# Altium schematic sheet 08_LMS7002M_2_Power.SchDoc: LMS7002M #2 power supply
size A3 portrait; Organization: Lime Microsystems; Address1: Surrey Tech Centre; Address2: Guildford GU2 7YG; Address3: Surrey; Address4: United Kingdom; Revision: v1.2; SheetNumber: 8; SheetTotal: 27; PageSetup: Record=PageOptions|CenterHorizontal=True|CenterVertical=True|PrintScale=0.70|XCorrection=1.00|YCorrection=1.00|PrintKind=1|BorderSize=5000000|LeftOffset=0|BottomOffset=0|Orientation=1|PaperLength=2970|PaperWidth=2100|Scale=100|PaperSource=7|PrintQuality=600|MediaType=1|DitherType=10|PrintScaleMode=1|PaperKind=A4|PaperIndex=9
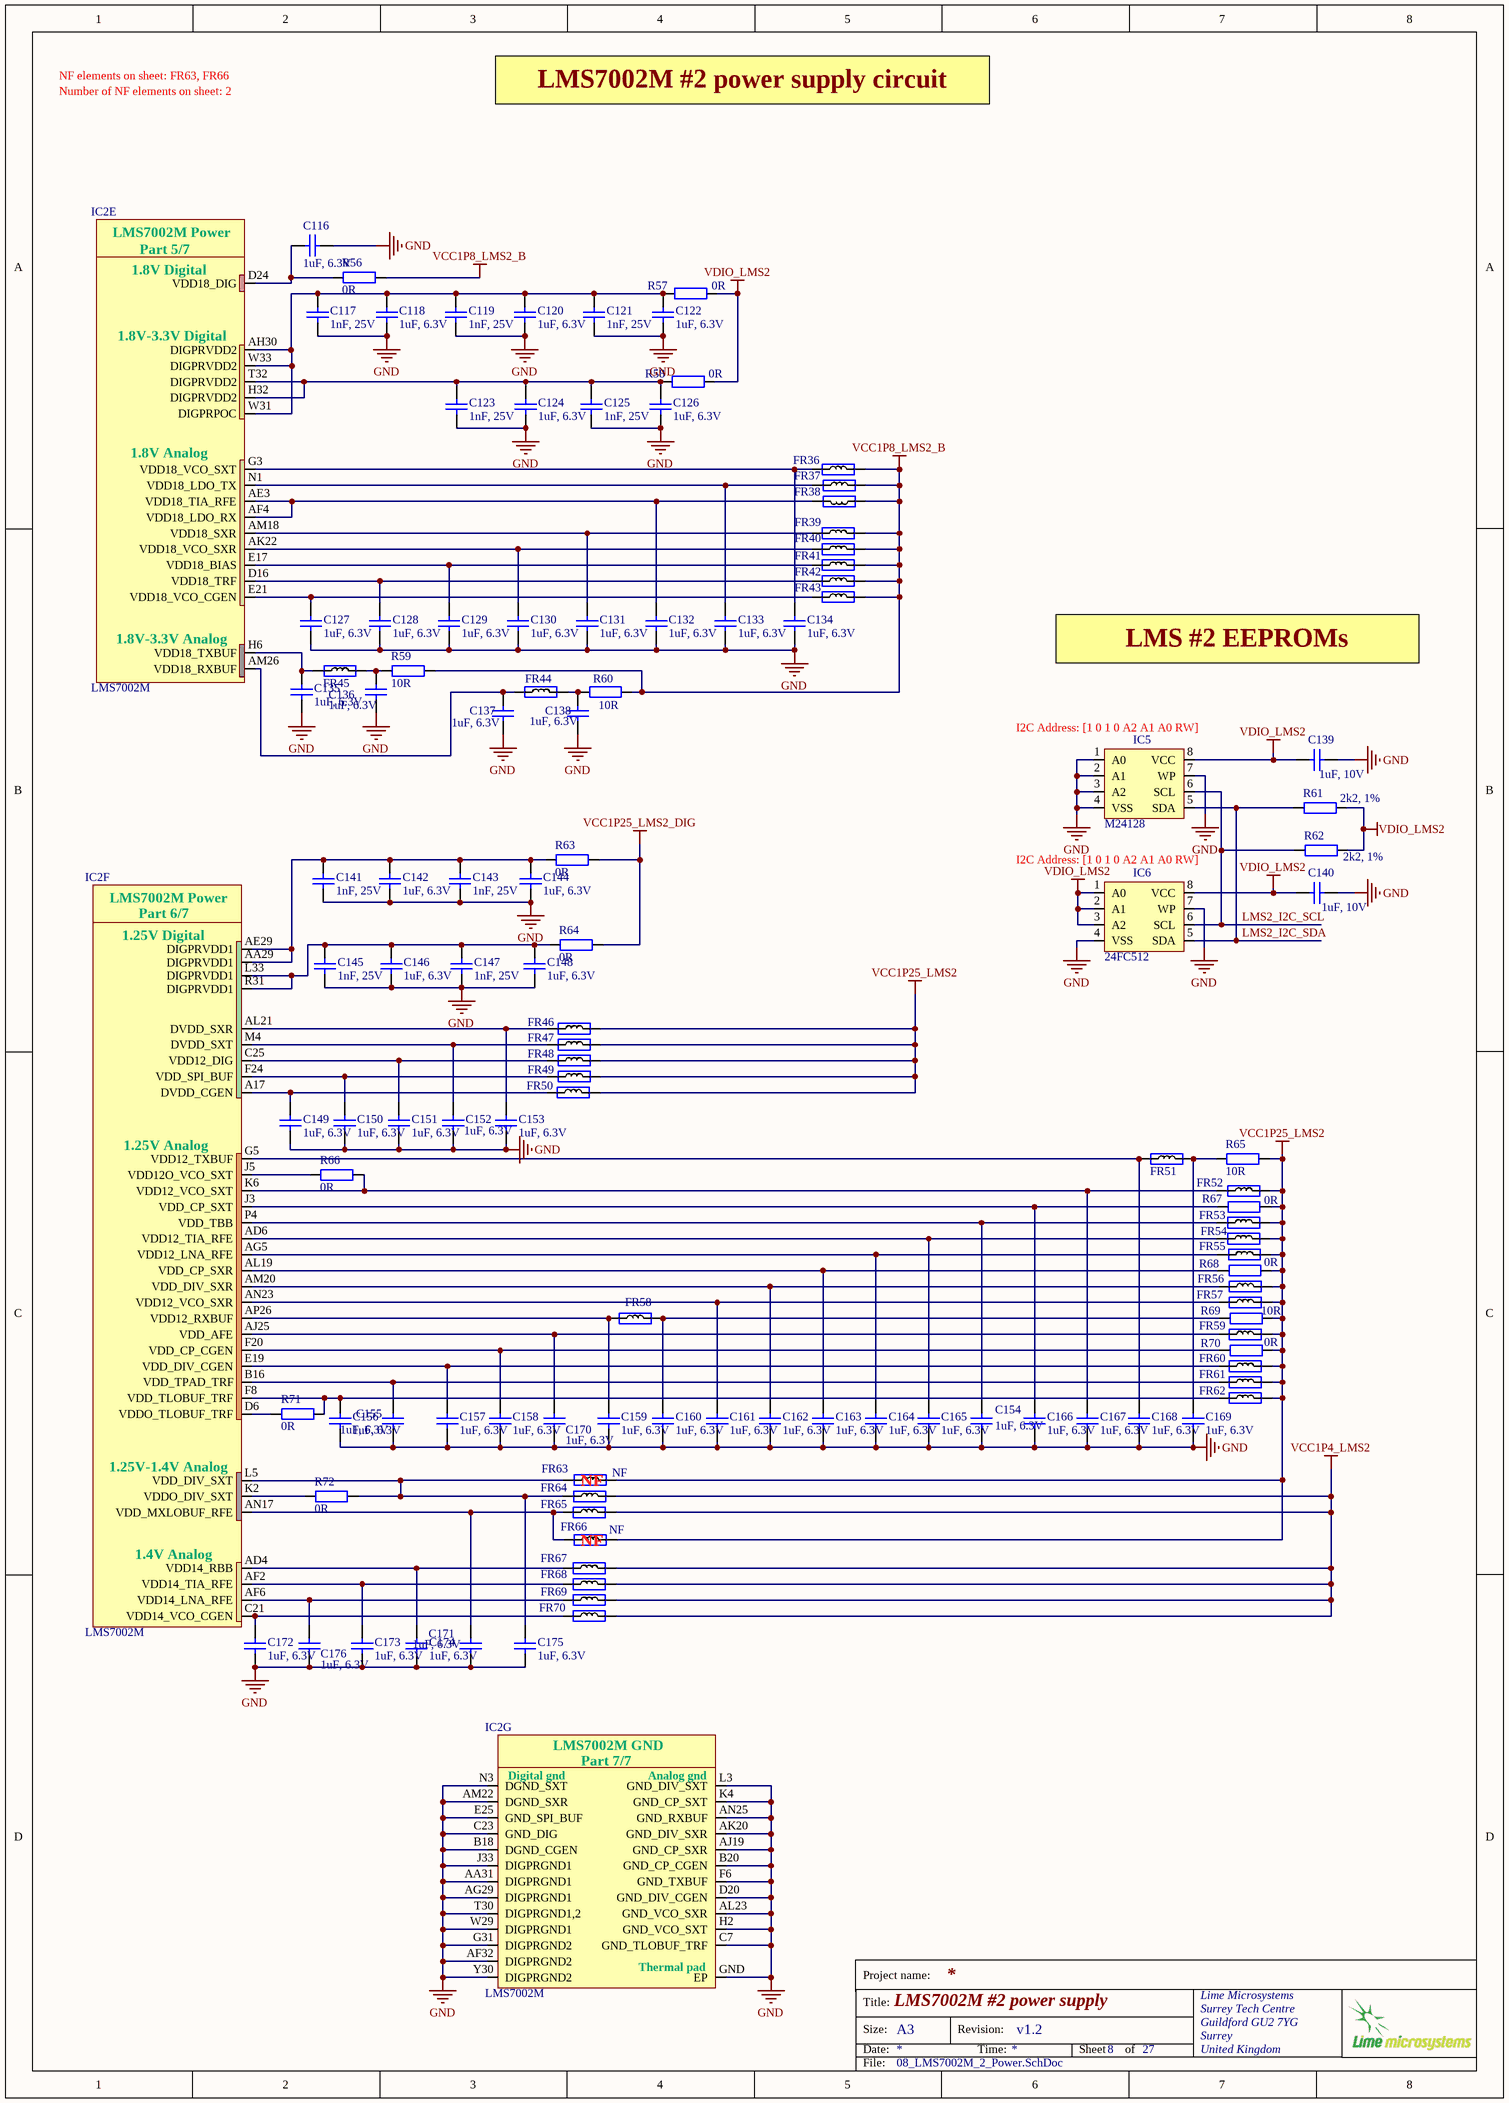
[diagram p0: 08_LMS7002M_2_Power.SchDoc]

## Parts
C116  1uF, 6.3V  [CAP0201]
C117  1nF, 25V  [CAP0201]
C118  1uF, 6.3V  [CAP0201]
C119  1nF, 25V  [CAP0201]
C120  1uF, 6.3V  [CAP0201]
C121  1nF, 25V  [CAP0201]
C122  1uF, 6.3V  [CAP0201]
C123  1nF, 25V  [CAP0201]
C124  1uF, 6.3V  [CAP0201]
C125  1nF, 25V  [CAP0201]
C126  1uF, 6.3V  [CAP0201]
C127  1uF, 6.3V  [CAP0201]
C128  1uF, 6.3V  [CAP0201]
C129  1uF, 6.3V  [CAP0201]
C130  1uF, 6.3V  [CAP0201]
C131  1uF, 6.3V  [CAP0201]
C132  1uF, 6.3V  [CAP0201]
C133  1uF, 6.3V  [CAP0201]
C134  1uF, 6.3V  [CAP0201]
C135  1uF, 6.3V  [CAP0201]
C136  1uF, 6.3V  [CAP0201]
C137  1uF, 6.3V  [CAP0201]
C138  1uF, 6.3V  [CAP0201]
C139  1uF, 10V  [CAP0402]
C140  1uF, 10V  [CAP0402]
C141  1nF, 25V  [CAP0201]
C142  1uF, 6.3V  [CAP0201]
C143  1nF, 25V  [CAP0201]
C144  1uF, 6.3V  [CAP0201]
C145  1nF, 25V  [CAP0201]
C146  1uF, 6.3V  [CAP0201]
C147  1nF, 25V  [CAP0201]
C148  1uF, 6.3V  [CAP0201]
C149  1uF, 6.3V  [CAP0201]
C150  1uF, 6.3V  [CAP0201]
C151  1uF, 6.3V  [CAP0201]
C152  1uF, 6.3V  [CAP0201]
C153  1uF, 6.3V  [CAP0201]
C154  1uF, 6.3V  [CAP0201]
C155  1uF, 6.3V  [CAP0201]
C156  1uF, 6.3V  [CAP0201]
C157  1uF, 6.3V  [CAP0201]
C158  1uF, 6.3V  [CAP0201]
C159  1uF, 6.3V  [CAP0201]
C160  1uF, 6.3V  [CAP0201]
C161  1uF, 6.3V  [CAP0201]
C162  1uF, 6.3V  [CAP0201]
C163  1uF, 6.3V  [CAP0201]
C164  1uF, 6.3V  [CAP0201]
C165  1uF, 6.3V  [CAP0201]
C166  1uF, 6.3V  [CAP0201]
C167  1uF, 6.3V  [CAP0201]
C168  1uF, 6.3V  [CAP0201]
C169  1uF, 6.3V  [CAP0201]
C170  1uF, 6.3V  [CAP0201]
C171  1uF, 6.3V  [CAP0201]
C172  1uF, 6.3V  [CAP0201]
C173  1uF, 6.3V  [CAP0201]
C174  1uF, 6.3V  [CAP0201]
C175  1uF, 6.3V  [CAP0201]
C176  1uF, 6.3V  [CAP0201]
FR36  Ferrite  [RES0201]  (value not drawn)
FR37  Ferrite  [RES0201]  (value not drawn)
FR38  Ferrite  [RES0201]  (value not drawn)
FR39  Ferrite  [RES0201]  (value not drawn)
FR40  Ferrite  [RES0201]  (value not drawn)
FR41  Ferrite  [RES0201]  (value not drawn)
FR42  Ferrite  [RES0201]  (value not drawn)
FR43  Ferrite  [RES0201]  (value not drawn)
FR44  Ferrite  [RES0201]  (value not drawn)
FR45  Ferrite  [RES0201]  (value not drawn)
FR46  Ferrite  [RES0201]  (value not drawn)
FR47  Ferrite  [RES0201]  (value not drawn)
FR48  Ferrite  [RES0201]  (value not drawn)
FR49  Ferrite  [RES0201]  (value not drawn)
FR50  Ferrite  [RES0201]  (value not drawn)
FR51  Ferrite  [RES0201]  (value not drawn)
FR52  Ferrite  [RES0201]  (value not drawn)
FR53  Ferrite  [RES0201]  (value not drawn)
FR54  Ferrite  [RES0201]  (value not drawn)
FR55  Ferrite  [RES0201]  (value not drawn)
FR56  Ferrite  [RES0201]  (value not drawn)
FR57  Ferrite  [RES0201]  (value not drawn)
FR58  Ferrite  [RES0201]  (value not drawn)
FR59  Ferrite  [RES0201]  (value not drawn)
FR60  Ferrite  [RES0201]  (value not drawn)
FR61  Ferrite  [RES0201]  (value not drawn)
FR62  Ferrite  [RES0201]  (value not drawn)
FR63  Assembly Info: NF  [RES0201]  (hidden comment: Ferrite)
FR64  Ferrite  [RES0201]  (value not drawn)
FR65  Ferrite  [RES0201]  (value not drawn)
FR66  Assembly Info: NF  [RES0201]  (hidden comment: Ferrite)
FR67  Ferrite  [RES0201]  (value not drawn)
FR68  Ferrite  [RES0201]  (value not drawn)
FR69  Ferrite  [RES0201]  (value not drawn)
FR70  Ferrite  [RES0201]  (value not drawn)
IC2  LMS7002M  [LMS7002M_v4]  (parts E,F,G of 7)
IC5  M24128  [24FC512]
IC6  24FC512  [24FC512]
R56  0R  [RES0201]
R57  0R  [RES0402]
R58  0R  [RES0402]
R59  10R  [RES0201]
R60  10R  [RES0201]
R61  2k2, 1%  [RES0402]
R62  2k2, 1%  [RES0402]
R63  0R  [RES0402]
R64  0R  [RES0402]
R65  10R  [RES0201]
R66  0R  [RES0201]
R67  0R  [RES0201]
R68  0R  [RES0201]
R69  10R  [RES0201]
R70  0R  [RES0201]
R71  0R  [RES0201]
R72  0R  [RES0201]

## Nets
GND: C116.2 C117.2 C118.2 C119.2 C120.2 C121.2 C122.2 C123.2 C124.2 C125.2 C126.2 C127.2 C128.2 C129.2 C130.2 C131.2 C132.2 C133.2 C134.2 C135.2 C136.2 C137.2 C138.2 C139.1 C140.1 C141.2 C142.2 C143.2 C144.2 C145.2 C146.2 C147.2 C148.2 C149.2 C150.2 C151.2 C152.2 C153.2 C154.2 C155.2 C156.2 C157.2 C158.2 C159.2 C160.2 C161.2 C162.2 C163.2 C164.2 C165.2 C166.2 C167.1 C168.2 C169.2 C170.2 C171.2 C172.2 C173.2 C174.2 C175.2 C176.2 IC2.AA31(DIGPRGND1) IC2.AF32(DIGPRGND2) IC2.AG29(DIGPRGND1) IC2.AJ19(GND_CP_SXR) IC2.AK20(GND_DIV_SXR) IC2.AL23(GND_VCO_SXR) IC2.AM22(DGND_SXR) IC2.AN25(GND_RXBUF) IC2.B18(DGND_CGEN) IC2.B20(GND_CP_CGEN) IC2.C7(GND_TLOBUF_TRF) IC2.C23(GND_DIG) IC2.D20(GND_DIV_CGEN) IC2.E25(GND_SPI_BUF) IC2.F6(GND_TXBUF) IC2.G31(DIGPRGND2) IC2.GND(EP) IC2.H2(GND_VCO_SXT) IC2.J33(DIGPRGND1) IC2.K4(GND_CP_SXT) IC2.L3(GND_DIV_SXT) IC2.N3(DGND_SXT) IC2.T30(DIGPRGND1,2) IC2.W29(DIGPRGND1) IC2.Y30(DIGPRGND2) IC5.1(A0) IC5.2(A1) IC5.3(A2) IC5.4(VSS) IC5.7(WP) IC6.4(VSS) IC6.7(WP)
VCC1P4_LMS2: FR64.1 FR65.2 FR67.2 FR68.2 FR69.2 FR70.2
VCC1P8_LMS2_B: FR36.2 FR37.1 FR38.1 FR39.2 FR40.2 FR41.2 FR42.2 FR43.2 R56.2 R59.2 R60.1
VCC1P25_LMS2: FR46.1 FR47.1 FR48.1 FR49.1 FR50.2 FR52.1 FR53.1 FR54.1 FR55.1 FR56.2 FR57.2 FR59.2 FR60.2 FR61.2 FR62.2 FR63.1 FR66.2 R65.2 R67.2 R68.1 R69.1 R70.1
VCC1P25_LMS2_DIG: R63.2 R64.2
VDIO_LMS2: C139.2 C140.2 IC5.8(VCC) IC6.1(A0) IC6.2(A1) IC6.3(A2) IC6.8(VCC) R57.1 R58.1 R61.1 R62.1
LMS2_I2C_SCL: IC5.6(SCL) IC6.6(SCL) R62.2
LMS2_I2C_SDA: IC5.5(SDA) IC6.5(SDA) R61.2
NetC116_1: C116.1 IC2.D24(VDD18_DIG) R56.1
NetC117_1: C117.1 C118.1 C119.1 C120.1 C121.1 C122.1 IC2.AH30(DIGPRVDD2) IC2.W31(DIGPRPOC) IC2.W33(DIGPRVDD2) R57.2
NetC123_1: C123.1 C124.1 C125.1 C126.1 IC2.H32(DIGPRVDD2) IC2.T32(DIGPRVDD2) R58.2
NetC127_1: C127.1 FR43.1 IC2.E21(VDD18_VCO_CGEN)
NetC128_1: C128.1 FR42.1 IC2.D16(VDD18_TRF)
NetC129_1: C129.1 FR41.1 IC2.E17(VDD18_BIAS)
NetC130_1: C130.1 FR40.1 IC2.AK22(VDD18_VCO_SXR)
NetC131_1: C131.1 FR39.1 IC2.AM18(VDD18_SXR)
NetC132_1: C132.1 FR38.2 IC2.AE3(VDD18_TIA_RFE) IC2.AF4(VDD18_LDO_RX)
NetC133_1: C133.1 FR37.2 IC2.N1(VDD18_LDO_TX)
NetC134_1: C134.1 FR36.1 IC2.G3(VDD18_VCO_SXT)
NetC135_1: C135.1 FR45.2 IC2.H6(VDD18_TXBUF)
NetC136_1: C136.1 FR45.1 R59.1
NetC137_1: C137.1 FR44.1 IC2.AM26(VDD18_RXBUF)
NetC138_1: C138.1 FR44.2 R60.2
NetC141_1: C141.1 C142.1 C143.1 C144.1 IC2.AA29(DIGPRVDD1) IC2.AE29(DIGPRVDD1) R63.1
NetC145_1: C145.1 C146.1 C147.1 C148.1 IC2.L33(DIGPRVDD1) IC2.R31(DIGPRVDD1) R64.1
NetC149_1: C149.1 FR50.1 IC2.A17(DVDD_CGEN)
NetC150_1: C150.1 FR49.2 IC2.F24(VDD_SPI_BUF)
NetC151_1: C151.1 FR48.2 IC2.C25(VDD12_DIG)
NetC152_1: C152.1 FR47.2 IC2.M4(DVDD_SXT)
NetC153_1: C153.1 FR46.2 IC2.AL21(DVDD_SXR)
NetC154_1: C154.1 FR53.2 IC2.P4(VDD_TBB)
NetC155_1: C155.1 FR60.1 IC2.B16(VDD_TPAD_TRF)
NetC156_1: C156.1 FR62.1 IC2.F8(VDD_TLOBUF_TRF) R71.1
NetC157_1: C157.1 FR61.1 IC2.E19(VDD_DIV_CGEN)
NetC158_1: C158.1 IC2.F20(VDD_CP_CGEN) R70.2
NetC159_1: C159.1 FR58.1 IC2.AP26(VDD12_RXBUF)
NetC160_1: C160.1 FR58.2 R69.2
NetC161_1: C161.1 FR57.1 IC2.AN23(VDD12_VCO_SXR)
NetC162_1: C162.1 FR56.1 IC2.AM20(VDD_DIV_SXR)
NetC163_1: C163.1 IC2.AL19(VDD_CP_SXR) R68.2
NetC164_1: C164.1 FR55.2 IC2.AG5(VDD12_LNA_RFE)
NetC165_1: C165.1 FR54.2 IC2.AD6(VDD12_TIA_RFE)
NetC166_1: C166.1 IC2.J3(VDD_CP_SXT) R67.1
NetC167_2: C167.2 FR52.2 IC2.K6(VDD12_VCO_SXT) R66.2
NetC168_1: C168.1 FR51.2 IC2.G5(VDD12_TXBUF)
NetC169_1: C169.1 FR51.1 R65.1
NetC170_1: C170.1 FR59.1 IC2.AJ25(VDD_AFE)
NetC171_1: C171.1 FR65.1 FR66.1 IC2.AN17(VDD_MXLOBUF_RFE)
NetC172_1: C172.1 FR70.1 IC2.C21(VDD14_VCO_CGEN)
NetC173_1: C173.1 FR68.1 IC2.AF2(VDD14_TIA_RFE)
NetC174_1: C174.1 FR67.1 IC2.AD4(VDD14_RBB)
NetC175_1: C175.1 FR63.2 FR64.2 IC2.L5(VDD_DIV_SXT) R72.2
NetC176_1: C176.1 FR69.1 IC2.AF6(VDD14_LNA_RFE)
NetIC2_D6: IC2.D6(VDDO_TLOBUF_TRF) R71.2
NetIC2_J5: IC2.J5(VDD12O_VCO_SXT) R66.1
NetIC2_K2: IC2.K2(VDDO_DIV_SXT) R72.1

## Notes on the sheet
- NF elements on sheet: FR63, FR66
- Number of NF elements on sheet: 2
- LMS7002M #2 power supply circuit
- LMS #2 EEPROMs
- (near IC5) I2C Address: [1 0 1 0 A2 A1 A0 RW]
- (near IC6) I2C Address: [1 0 1 0 A2 A1 A0 RW]
- (near FR63) NF
- (near FR66) NF
- Project name:
- Title:
- Size:
- Date:
- A3
- Revision:
- Time:
- Sheet
- of
- File:
- (in symbol LMS7002Mr3, part E) LMS7002M Power; Part 5/7; 1.8V Digital; 1.8V-3.3V Digital; 1.8V Analog; 1.8V-3.3V Analog
- (in symbol LMS7002Mr3, part F) LMS7002M Power; Part 6/7; 1.25V Digital; 1.25V Analog; 1.25V-1.4V Analog; 1.4V Analog
- (in symbol LMS7002Mr3, part G) LMS7002M GND; Part 7/7; Digital gnd; Analog gnd; Thermal pad

## Library data of the parts
C116 C118 C120 C122 C124 C126-C138 C142 C144 C146 C148-C176 = Cap_0402: Manufacturer: TDK Corporation; Manufacturer Part Number 1: C0603X5R0J105M030BC; Part Description: 1µF ±20% 6.3V Ceramic Capacitor X5R 0201 (0603 Metric); Tolerance: ±20%; Capacitance: 1.0µF; Temperature Coefficient: X5R; Value: 1uF, 6.3V; Supplier 1: Digi-Key; Supplier Part Number 1: 445-8008-1-ND; Applications: General Purpose; Features: -; Lead Style: -; Ratings: -; Thickness (Max): -; Lead Spacing: -; Height - Seated (Max): -; Size / Dimension: 0.024" L x 0.012" W (0.60mm x 0.30mm); Mounting Type: Surface Mount, MLCC; Operating Temperature: -55°C ~ 85°C; Package / Case: 0201 (0603 Metric); Packaging: Cut Tape (CT); Voltage - Rated: 6.3V; Category: Capacitors; RoHS: RoHS Compliant
C117 C119 C121 C123 C125 C141 C143 C145 C147 = Cap_0402: Manufacturer Part Number 1: C0603X7R1E102K030BA; Manufacturer: TDK Corporation; Part Description: 1000pF ±10% 25V Ceramic Capacitor X7R 0201 (0603 Metric); Temperature Coefficient: X7R; Tolerance: ±10%; Capacitance: 1000pF; Value: 1nF, 25V; Supplier 1: Digi-Key; Supplier Part Number 1: 445-7275-1-ND; Voltage - Rated: 25V; Features: -; Package / Case: 0201 (0603 Metric); Lead Spacing: -; Mounting Type: Surface Mount, MLCC; Lead Style: -; Height - Seated (Max): -; Operating Temperature: -55°C ~ 125°C; Size / Dimension: 0.024" L x 0.012" W (0.60mm x 0.30mm); Applications: General Purpose; Ratings: -; Thickness (Max): 0.013" (0.33mm); RoHS: RoHS Compliant; Packaging: Cut Tape (CT); Category: Capacitors
C139 C140 = Cap_0402: Manufacturer Part Number 1: GRM155R61A105KE15J; Manufacturer: TDK; Part Description: 1µF ±10% 10V Ceramic Capacitor X5R 0402 (1005 Metric); Voltage Rating: 10; Capacitance Tolerance: ± 10%; Product Range: TDK - C Series; Ceramic Capacitor Case: 0402 [1005 Metric]; Capacitance: 1; Dielectric Characteristic: X6; Value: 1uF, 10V; Supplier 1: Newark; Supplier Part Number 1: 490-6298-2-ND; MSL: -; RoHS: YES
FR36-FR70 = Ferrite: Manufacturer Part Number 1: BK0603TS601-T; Manufacturer: Taiyo Yuden; Part Description: FERRITE BEAD 600 OHM 0201 1LN; DC Resistance (DCR): 750 mOhm Max; Filter Type: Differential Mode - Single; Impedance @ Frequency: 600 Ohm @ 100MHz; Current Rating: 270mA; Value: 600R@100MHz; Supplier 1: Digi-Key; Supplier Part Number 1: 587-3277-1-ND; Size / Dimension: 0.024" L x 0.012" W (0.60mm x 0.30mm); Package / Case: 0201 (0603 Metric); Height (Max): 0.013" (0.33mm); Mounting Type: Surface Mount; Packaging: Cut Tape (CT); RoHS: RoHS Compliant; Category: Filters
IC2 = LMS7002Mr3: Schematic symbol revision 3. Default footprint - 0.31mm pad; Manufacturer: Lime Microsystems; Part Description: IC FPRF Transceiver LMS7002M; 261 pin aQFN; Supplier 1: Lime Microsystems; Supplier Part Number 1: LMS7002M; Manufacturer Part Number 1: LMS7002M
IC5 = 24FC64F: Part Description: IC EEPROM 128KBIT 1MHZ 8TSSOP; Manufacturer: STMicroelectronics; Manufacturer Part Number 1: M24128-DRDW8TP/K; Format - Memory: EEPROMs - Serial; Memory Type: EEPROM; Memory Size: 128K (16K x 8); Speed: 1MHz; Interface: I²C, 2-Wire Serial; Voltage - Supply: 1.8 V ~ 5.5 V; Supplier 1: Digi-Key; Supplier Part Number 1: 497-15336-1-ND; RoHS: RoHS Compliant; Category: Integrated Circuits (ICs); Stock 1: 1677; Pricing 1: 1=0.47, 10=0.464, 100=0.3805, 500=0.36996, 1000=0.36005 (USD); Packaging: Cut Tape (CT); Part Status: Active; Operating Temperature: -40°C ~ 105°C (TA); Package / Case: 8-TSSOP (0.173", 4.40mm Width); Supplier Device Package: 8-TSSOP; ComponentLink1URL: http://www.st.com/content/ccc/resource/technical/document/datasheet/5c/f3/4b/70/8e/63/48/95/DM00149696.pdf/files/DM00149696.pdf/jcr:content/translations/en.DM00149696.pdf; ComponentLink1Description: http://www.st.com/content/ccc/resource/technical/document/datasheet/5c/f3/4b/70/8e/63/48/95/DM00149696.pdf/files/DM00149696.pdf/jcr:content/translations/en.DM00149696.pdf
IC6 = 24FC512: Manufacturer Part Number 1: 24FC512-I/ST; Manufacturer: Microchip Technology; Part Description: IC EEPROM 512KBIT 1MHZ 8TSSOP; Speed: 400kHz, 1MHz; Memory Type: EEPROM; Memory Size: 512K (64K x 8); Voltage - Supply: 1.7 V ~ 5.5 V; Interface: I²C, 2-Wire Serial; Format - Memory: EEPROMs - Serial; Supplier 1: Digi-Key; RoHS: RoHS Compliant; Packaging: Tube; Operating Temperature: -40°C ~ 85°C; Supplier Device Package: 8-TSSOP; Category: Integrated Circuits (ICs); Package / Case: 8-TSSOP (0.173", 4.40mm Width); Supplier Part Number 1: 24FC512-I/ST-ND
R56 R66-R68 R70-R72 = Res_0402: Manufacturer Part Number 1: MCR006YRTJ000; Manufacturer: Rohm Semiconductor; Part Description: RES SMD 0.0OHM JUMPER 1/20W 0201; Resistance (Ohms): 0.0; Power (Watts): 0.05W, 1/20W; Tolerance: Jumper; Value: 0R; Supplier 1: Digi-Key; Supplier Part Number 1: RHM0.0CCCT-ND; Number of Terminations: 2; Operating Temperature: -55°C ~ 125°C; Package / Case: 0201 (0603 Metric); Height: 0.010" (0.26mm); Supplier Device Package: 0201 (0603 Metric); Size / Dimension: 0.024" L x 0.012" W (0.60mm x 0.30mm); Temperature Coefficient: -; Category: Resistors; Features: -; RoHS: RoHS Compliant; Composition: Thick Film; Packaging: Cut Tape (CT)
R57 R58 R63 R64 = Res_0402: Manufacturer Part Number 1: RC0402JR-070RL; Manufacturer: Yageo; Part Description: RES SMD 0.0OHM JUMPER 1/16W 0402; Resistance (Ohms): 0.0; Tolerance: Jumper; Power (Watts): 0.063W, 1/16W; Value: 0R; Supplier 1: Digi-Key; Supplier Part Number 1: 311-0.0JRTR-ND; Category: Resistors; Temperature Coefficient: -; Features: Moisture Resistant; Supplier Device Package: 0402; Height: 0.016" (0.40mm); Package / Case: 0402 (1005 Metric); Operating Temperature: -55°C ~ 155°C; Size / Dimension: 0.039" L x 0.020" W (1.00mm x 0.50mm); Composition: Thick Film; Packaging: Tape & Reel (TR); Number of Terminations: 2; RoHS: RoHS Compliant
R59 R60 R65 R69 = Res_0402: Manufacturer: Panasonic Electronic Components; Part Description: RES SMD 10 OHM 1% 1/20W 0201; Manufacturer Part Number 1: ERJ-1GEF10R0C; Power (Watts): 0.05W, 1/20W; Resistance (Ohms): 10; Tolerance: ±1%; Temperature Coefficient: ±200ppm/°C; Value: 10R; Supplier 1: Digi-Key; Supplier Part Number 1: P10.0ABCT-ND; Package / Case: 0201 (0603 Metric); Height: 0.010" (0.26mm); Supplier Device Package: 0201; Packaging: Cut Tape (CT); Composition: Thick Film; Category: Resistors; Number of Terminations: 2; Size / Dimension: 0.024" L x 0.012" W (0.60mm x 0.30mm); Operating Temperature: -55°C ~ 125°C; Features: -; RoHS: RoHS Compliant
R61 R62 = Res_0402: Manufacturer: Stackpole Electronics Inc; Manufacturer Part Number 1: RMCF0402FT2K20; Part Description: RES SMD 2.2K OHM 1% 1/16W 0402; Resistance (Ohms): 2.2k; Temperature Coefficient: ±100ppm/°C; Power (Watts): 0.063W, 1/16W; Value: 2k2, 1%; Supplier 1: Digi-Key; Supplier Part Number 1: RMCF0402FT2K20CT-ND; Supplier Device Package: 0402; Package / Case: 0402 (1005 Metric); Size / Dimension: 0.039" L x 0.020" W (1.00mm x 0.50mm); Operating Temperature: -55°C ~ 155°C; Composition: Thick Film; Category: Resistors; Features: -; Height: 0.016" (0.40mm); RoHS: RoHS Compliant; Number of Terminations: 2; Packaging: Cut Tape (CT); Tolerance: ±1%